# Altium project caton-m-trad.PrjPcb
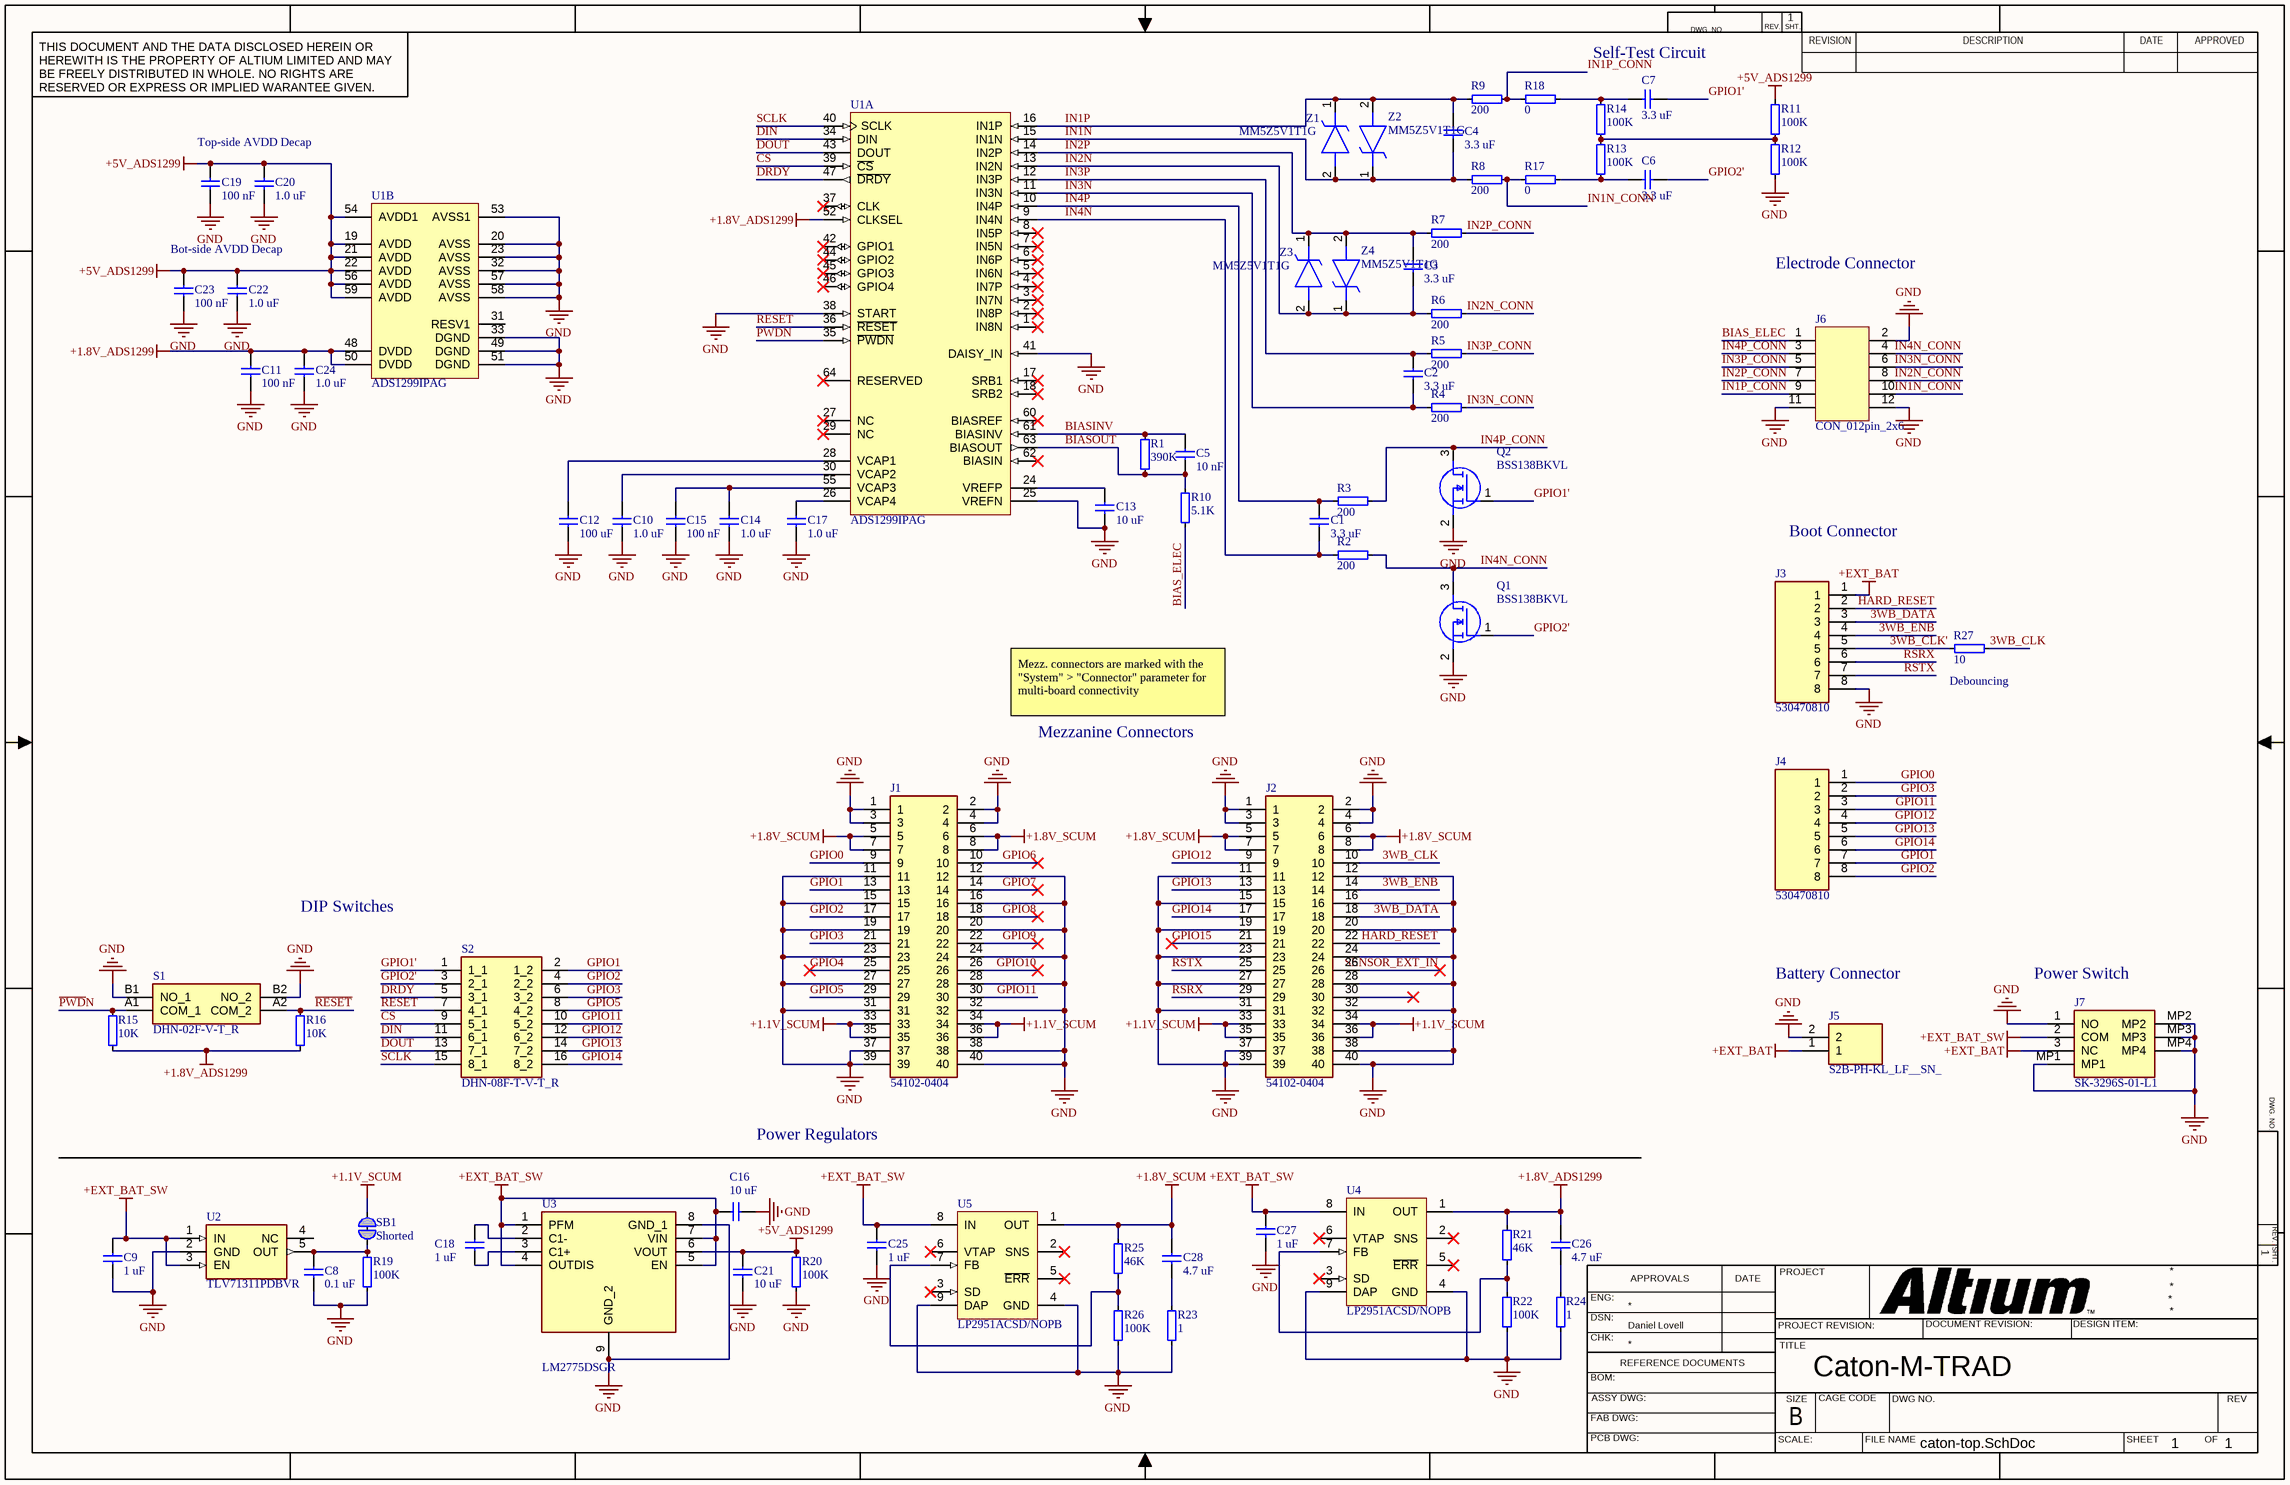
[diagram p0: caton-top.SchDoc]
1 sheet, 76 parts. Net scope: hierarchical (ports join the sheet entries above them; power ports are global).
Board file: caton.PcbDoc

## Sheet caton-top.SchDoc: Caton-M-TRAD
size 431 x 279 mm; Date: 7/9/2024; Author: Daniel Lovell; CompanyName: University of California, Berkeley; DrawnBy: Daniel Lovell; Organization: BSAC; Revision: A; SheetNumber: 1; SheetTotal: 1

### Parts
C1  3.3 uF  [0402]
C2  3.3 uF  [0402]
C3  3.3 uF  [0402]
C4  3.3 uF  [0402]
C5  10 nF  [0402]
C6  3.3 uF  [0402]
C7  3.3 uF  [0402]
C8  0.1 uF  [0402]
C9  1 uF  [0402]
C10  1.0 uF  [0402]
C11  100 nF  [0402]
C12  100 uF  [0805]
C13  10 uF  [0402]
C14  1.0 uF  [0402]
C15  100 nF  [0402]
C16  10 uF  [0402]
C17  1.0 uF  [0402]
C18  1 uF  [0402]
C19  100 nF  [0402]
C20  1.0 uF  [0402]
C21  10 uF  [0402]
C22  1.0 uF  [0402]
C23  100 nF  [0402]
C24  1.0 uF  [0402]
C25  1 uF  [0402]
C26  4.7 uF  [0402]
C27  1 uF  [0402]
C28  4.7 uF  [0402]
J1  54102-0404  [541020404]
J2  54102-0404  [541020404]
J3  530470810  [530470810]
J4  530470810  [530470810]
J5  S2B-PH-KL_LF__SN_  [S2BPHKLLFSN]
J6  CON_012pin_2x6  [CON-012-100-600X200/2X6-POST]
J7  SK-3296S-01-L1  [SK3296S01L1]
Q1  BSS138BKVL  [SOT95P230X110-3N]
Q2  BSS138BKVL  [SOT95P230X110-3N]
R1  390K  [0402]
R2  200  [0402]
R3  200  [0402]
R4  200  [0402]
R5  200  [0402]
R6  200  [0402]
R7  200  [0402]
R8  200  [0402]
R9  200  [0402]
R10  5.1K  [0402]
R11  100K  [0402]
R12  100K  [0402]
R13  100K  [0402]
R14  100K  [0402]
R15  10K  [0402]
R16  10K  [0402]
R17  0  [0603]
R18  0  [0603]
R19  100K  [0402]
R20  100K  [0402]
R21  46K  [0402]
R22  100K  [0402]
R23  1  [0402]
R24  1  [0402]
R25  46K  [0402]
R26  100K  [0402]
R27  10  [0402]
S1  DHN-02F-V-T_R  [DHN02FVTR]
S2  DHN-08F-T-V-T_R  [DHN08FTVTR]
SB1  Shorted  [Solderbridge_Shorted]  (net tie, no BOM)
U1  ADS1299IPAG  [PAG0064A_L]  (parts A,B of 2)
U2  TLV71311PDBVR  [SOT95P280X145-5N]
U3  LM2775DSGR  [SON50P200X200X80-9N]
U4  LP2951ACSD/NOPB  [NGT0008A_V]
U5  LP2951ACSD/NOPB  [NGT0008A_V]
Z1  MM5Z5V1T1G  [SODFL1608X70N]
Z2  MM5Z5V1T1G  [SODFL1608X70N]
Z3  MM5Z5V1T1G  [SODFL1608X70N]
Z4  MM5Z5V1T1G  [SODFL1608X70N]

### Nets
+1.1V_SCUM: J1.33 J1.34 J1.35 J1.36 J2.33 J2.34 J2.35 J2.36 SB1.2
+1.8V_ADS1299: C11.1 C24.1 C26.1 R15.1 R16.1 R21.2 U1.48(DVDD) U1.50(DVDD) U1.52(CLKSEL) U4.1(OUT)
+1.8V_SCUM: C28.1 J1.5 J1.6 J1.7 J1.8 J2.5 J2.6 J2.7 J2.8 R25.2 U5.1(OUT)
+5V_ADS1299: C19.1 C20.1 C21.1 C22.1 C23.1 R11.2 R20.2 U1.19(AVDD) U1.21(AVDD) U1.22(AVDD) U1.54(AVDD1) U1.56(AVDD) U1.59(AVDD) U3.6(VOUT)
+EXT_BAT: J3.1 J5.1 J7.3(NC)
+EXT_BAT_SW: C9.2 C16.1 C25.1 C27.1 J7.2(COM) U2.1(IN) U2.3(EN) U3.1(PFM) U3.4(OUTDIS) U3.5(EN) U3.7(VIN) U4.8(IN) U5.8(IN)
GND: C8.1 C9.1 C10.2 C11.2 C12.2 C13.2 C14.2 C15.2 C16.2 C17.2 C19.2 C20.2 C21.2 C22.2 C23.2 C24.2 C25.2 C27.2 J1.1 J1.2 J1.3 J1.4 J1.11 J1.12 J1.15 J1.16 J1.19 J1.20 J1.23 J1.24 J1.27 J1.28 J1.31 J1.32 J1.37 J1.38 J1.39 J1.40 J2.1 J2.2 J2.3 J2.4 J2.11 J2.12 J2.15 J2.16 J2.19 J2.20 J2.23 J2.24 J2.27 J2.28 J2.31 J2.32 J2.37 J2.38 J2.39 J2.40 J3.8 J5.2 J6.2 J6.11 J6.12 J7.1(NO) J7.MP1 J7.MP2 J7.MP3 J7.MP4 Q1.2(S) Q2.2(S) R12.1 R19.1 R20.1 R22.1 R23.1 R24.1 R26.1 S1.B1(NO_1) S1.B2(NO_2) U1.20(AVSS) U1.23(AVSS) U1.25(VREFN) U1.32(AVSS) U1.33(DGND) U1.38(START) U1.41(DAISY_IN) U1.49(DGND) U1.51(DGND) U1.53(AVSS1) U1.57(AVSS) U1.58(AVSS) U2.2(GND) U3.8(GND_1) U3.9(GND_2) U4.4(GND) U4.9(DAP) U5.4(GND) U5.9(DAP)
3WB_CLK: J2.10 R27.1
3WB_CLK': J3.5 R27.2
3WB_DATA: J2.18 J3.3
3WB_ENB: J2.14 J3.4
~{CS}: S2.9(5_1) U1.39(~{CS})
~{DRDY}: S2.5(3_1) U1.47(~{DRDY})
~{PWD}N: R15.2 S1.A1(COM_1) U1.35(~{PWDN})
~{RESET}: R16.2 S1.A2(COM_2) S2.7(4_1) U1.36(~{RESET})
BIAS_ELEC: J6.1 R10.1
BIASINV: C5.1 R1.2 U1.61(BIASINV)
BIASOUT: C5.2 R1.1 R10.2 U1.63(BIASOUT)
DIN: S2.11(6_1) U1.34(DIN)
DOUT: S2.13(7_1) U1.43(DOUT)
GPIO0: J1.9 J4.1
GPIO1: J1.13 J4.7 S2.2(1_2)
GPIO1': C7.1 Q2.1(G) S2.1(1_1)
GPIO2: J1.17 J4.8 S2.4(2_2)
GPIO2': C6.1 Q1.1(G) S2.3(2_1)
GPIO3: J1.21 J4.2 S2.6(3_2)
GPIO4: J1.25
GPIO5: J1.29 S2.8(4_2)
GPIO6: J1.10
GPIO7: J1.14
GPIO8: J1.18
GPIO9: J1.22
GPIO10: J1.26
GPIO11: J1.30 J4.3 S2.10(5_2)
GPIO12: J2.9 J4.4 S2.12(6_2)
GPIO13: J2.13 J4.5 S2.14(7_2)
GPIO14: J2.17 J4.6 S2.16(8_2)
GPIO15: J2.21
HARD_RESET: J2.22 J3.2
IN1N: C4.1 R8.2 U1.15(IN1N) Z1.2(A) Z2.1(K)
IN1N_CONN: J6.10 R8.1 R17.2
IN1P: C4.2 R9.2 U1.16(IN1P) Z1.1(K) Z2.2(A)
IN1P_CONN: J6.9 R9.1 R18.2
IN2N: C3.1 R6.2 U1.13(IN2N) Z3.2(A) Z4.1(K)
IN2N_CONN: J6.8 R6.1
IN2P: C3.2 R7.2 U1.14(IN2P) Z3.1(K) Z4.2(A)
IN2P_CONN: J6.7 R7.1
IN3N: C2.1 R4.2 U1.11(IN3N)
IN3N_CONN: J6.6 R4.1
IN3P: C2.2 R5.2 U1.12(IN3P)
IN3P_CONN: J6.5 R5.1
IN4N: C1.1 R2.2 U1.9(IN4N)
IN4N_CONN: J6.4 Q1.3(D) R2.1
IN4P: C1.2 R3.2 U1.10(IN4P)
IN4P_CONN: J6.3 Q2.3(D) R3.1
RSRX: J2.29 J3.6
RSTX: J2.25 J3.7
SCLK: S2.15(8_1) U1.40(SCLK)
SENSOR_EXT_IN: J2.26
NetC6_2: C6.2 R13.1 R17.1
NetC7_2: C7.2 R14.2 R18.1
NetC8_2: C8.2 R19.2 SB1.1 U2.5(OUT)
NetC10_1: C10.1 U1.30(VCAP2)
NetC12_1: C12.1 U1.28(VCAP1)
NetC13_1: C13.1 U1.24(VREFP)
NetC14_1: C14.1 C15.1 U1.55(VCAP3)
NetC17_1: C17.1 U1.26(VCAP4)
NetC18_1: C18.1 U3.3(C1+)
NetC18_2: C18.2 U3.2(C1-)
NetC26_2: C26.2 R24.2
NetC28_2: C28.2 R23.2
NetR11_1: R11.1 R12.2 R13.2 R14.1
NetR21_1: R21.1 R22.2 U4.7(FB)
NetR25_1: R25.1 R26.2 U5.7(FB)

Not connected (* = marked no-connect by the designer): J2 30*; U1 1(IN8N)* 2(IN8P)* 3(IN7N)* 4(IN7P)* 5(IN6N)* 6(IN6P)* 7(IN5N)* 8(IN5P)* 17(SRB1)* 18(SRB2)* 27(NC)* 29(NC)* 31(RESV1) 37(CLK)* 42(GPIO1)* 44(GPIO2)* 45(GPIO3)* 46(GPIO4)* 60(BIASREF)* 62(BIASIN)* 64(RESERVED)*; U2 4(NC); U4 2(SNS)* 3(SD)* 5(~{ERR})* 6(VTAP)*; U5 2(SNS)* 3(SD)* 5(~{ERR})* 6(VTAP)*

### Notes on the sheet
- Self-Test Circuit
- Top-side AVDD Decap
- Bot-side AVDD Decap
- Electrode Connector
- Boot Connector
- (near R27) Debouncing
- Mezz. connectors are marked with the "System" > "Connector" parameter for multi-board connectivity
- Mezzanine Connectors
- DIP Switches
- Battery Connector
- (near J7) Power Switch
- Power Regulators
- DWG. NO.
- REV.
- SHT.
- THIS DOCUMENT AND THE DATA DISCLOSED HEREIN OR HEREWITH IS THE PROPERTY OF ALTIUM LIMITED AND MAY BE FREELY DISTRIBUTED IN WHOLE. NO RIGHTS ARE RESERVED OR EXPRESS OR IMPLIED WARANTEE GIVEN.
- REVISION
- DESCRIPTION
- DATE
- APPROVED
- ENG:
- APPROVALS
- PROJECT
- DSN:
- CHK:
- REFERENCE DOCUMENTS
- PROJECT REVISION:
- TITLE
- DOCUMENT REVISION:
- DESIGN ITEM:
- BOM:
- FAB DWG:
- PCB DWG:
- ASSY DWG:
- SCALE:
- SIZE
- B
- CAGE CODE
- FILE NAME
- DWG NO.
- SHEET
- OF
- REV

### Library data of the parts
C1-C7 C10 C11 C13-C15 C17 C19 C20 C22-C24 C26 = C0402: Capacitor, 0402, X5R, ±20%; Part Number: C0402-4µ7; Manufacturer: N.A.; Part number IPS: 00000001251, 00000007165; Note: 10V; Artikkelnr Noca: 20039482; Pad Count: 2; Manufacturer Part Number: N.A.; LatestRevisionDate: 2017-11-09; Published: 2009-05-08; Footprint Doc: 0402; ComponentLink1Description: Datasheet; ComponentLink1URL: N.A.; ComponentLink2Description: Supplier link; ComponentLink2URL: N.A.; HelpURL: N.A.; Supplier 1: Digi-Key; Supplier Part Number 1: 490-13252-1-ND; Supplier 2: N.A.; Supplier Part Number 2: N.A.; PartId: 100200193; Component Class: Capacitors; Author: rsk; Part number Norautron: N.A.
  C1-C4 C6 C7: Value: 3.3 uF
  C5: Value: 10 nF
  C10 C14 C17 C20 C22 C24: Value: 1.0 uF
  C11 C15 C19 C23: Value: 100 nF
  C13: Value: 10 uF
  C26: Value: 4.7 uF
C8 C28 = C0402: Capacitor, 0402, X7R, ±20%; Part Number: C0402-4µ7; Manufacturer: N.A.; Part number IPS: 00000001251, 00000007165; Note: 10V; Artikkelnr Noca: 20039482; Pad Count: 2; Manufacturer Part Number: N.A.; LatestRevisionDate: 2017-11-09; Published: 2009-05-08; Footprint Doc: 0402; ComponentLink1Description: Datasheet; ComponentLink1URL: N.A.; ComponentLink2Description: Supplier link; ComponentLink2URL: N.A.; HelpURL: N.A.; Supplier 1: Digi-Key; Supplier Part Number 1: 490-13252-1-ND; Supplier 2: N.A.; Supplier Part Number 2: N.A.; PartId: 100200193; Component Class: Capacitors; Author: rsk; Part number Norautron: N.A.
  C8: Value: 0.1 uF
  C28: Value: 4.7 uF
C9 C16 C18 C21 C25 C27 = C0402: Capacitor, 0402, X7R, ±10%; Part Number: C0402-4µ7; Manufacturer: N.A.; Part number IPS: 00000001251, 00000007165; Note: 10V; Artikkelnr Noca: 20039482; Pad Count: 2; Manufacturer Part Number: N.A.; LatestRevisionDate: 2017-11-09; Published: 2009-05-08; Footprint Doc: 0402; ComponentLink1Description: Datasheet; ComponentLink1URL: N.A.; ComponentLink2Description: Supplier link; ComponentLink2URL: N.A.; HelpURL: N.A.; Supplier 1: Digi-Key; Supplier Part Number 1: 490-13252-1-ND; Supplier 2: N.A.; Supplier Part Number 2: N.A.; PartId: 100200193; Component Class: Capacitors; Author: rsk; Part number Norautron: N.A.
  C9 C18 C25 C27: Value: 1 uF
  C16 C21: Value: 10 uF
C12 = C0805: Capacitor, 0805; Part Number: C0603-4µ7; Manufacturer: N.A.; Part number IPS: 00000007783; Note: 6.3V; Artikkelnr Noca: 20069060; Pad Count: 2; Manufacturer Part Number: N.A.; LatestRevisionDate: 2009-11-23; Published: 2009-05-08; Value: 100 uF; Footprint Doc: 0603; ComponentLink1Description: Datasheet; ComponentLink1URL: N.A.; ComponentLink2Description: Supplier link; ComponentLink2URL: N.A.; HelpURL: N.A.; Supplier 1: N.A.; Supplier Part Number 1: N.A.; Supplier 2: N.A.; Supplier Part Number 2: N.A.; PartId: 100200274; Component Class: Capacitors; Author: rsk; Part number Norautron: N.A.
J1 J2 = 54102-0404: 0.50mm Pitch SlimStack Receptacle, Surface Mount, Dual Row, Vertical, 2.50mm Stacking Height, Gold Plating with Nickel Barrier, 40 Circuits; Manufacturer_Name: Molex; System: Connector; Datasheet Link: https://www.molex.com/pdm_docs/sd/541020404_sd.pdf; Height: 2.2mm; Manufacturer_Part_Number: 54102-0404; Mouser Part Number: 538-54102-0404; Mouser Price/Stock: https://www.mouser.co.uk/ProductDetail/Molex/54102-0404?qs=QVBMgXxBiLzLp7HESxZcuA%3D%3D
J3 J4 = 530470810: Connector; Manufacturer_Name: Molex; Datasheet Link: https://www.molex.com/pdm_docs/sd/530470210_sd.pdf; Height: 4.2mm; Manufacturer_Part_Number: 530470810
J5 = S2B-PH-KL_LF__SN_: Connector; Manufacturer_Name: JST (JAPAN SOLDERLESS TERMINALS); Manufacturer_Part_Number: S2B-PH-KL(LF)(SN); Datasheet Link: https://www.jst-mfg.com/product/pdf/eng/ePH.pdf; Height: 4.8mm
J6 = CON_012pin_2x6: Con 12 pins 2x6
J7 = SK-3296S-01-L1: Connector; Manufacturer_Name: XKB Connectivity; Datasheet Link: https://datasheet.lcsc.com/szlcsc/XKB-SK-3296S-01-L1_C319020.pdf; Height: 1.4mm; Manufacturer_Part_Number: SK-3296S-01-L1
Q1 Q2 = BSS138BKVL: MOSFET (N-Channel); Manufacturer_Name: Nexperia; Datasheet Link: https://assets.nexperia.com/documents/data-sheet/BSS138BK.pdf; Height: 1.1mm; Manufacturer_Part_Number: BSS138BKVL; Mouser Part Number: 771-BSS138BKVL; Mouser Price/Stock: https://www.mouser.co.uk/ProductDetail/Nexperia/BSS138BKVL?qs=45Avz0nZxhsC3lw2Q7S%2FBA%3D%3D; Arrow Part Number: BSS138BKVL; Arrow Price/Stock: https://www.arrow.com/en/products/bss138bkvl/nexperia?region=europe
R1-R16 R19-R27 = R0402: Resistor, 0402, ±1%, 0.05W; Part Number: R0201-10k; Manufacturer: N.A.; Part number IPS: 00000001255; Note: Chip Res 1%; Pad Count: 2; Manufacturer Part Number: N.A.; LatestRevisionDate: 2014-11-13; Published: 2014-11-13; Artikkelnr Noca: N.A.; Footprint Doc: 0201; ComponentLink1Description: Datasheet; ComponentLink1URL: N.A.; ComponentLink2Description: Supplier link; ComponentLink2URL: N.A.; HelpURL: N.A.; Supplier 1: N.A.; Supplier Part Number 1: N.A.; Supplier 2: N.A.; Supplier Part Number 2: N.A.; PartId: 100100065; Component Class: Resistors; Author: rsk; Part number Norautron: N.A.
  R1: Value: 390K
  R2-R9: Value: 200
  R10: Value: 5.1K
  R11-R14 R19 R20 R22 R26: Value: 100K
  R15 R16: Value: 10K
  R21 R25: Value: 46K
  R23 R24: Value: 1
  R27: Value: 10
R17 R18 = R0603: Resistor, 0603; Part Number: R0201-10k; Manufacturer: N.A.; Part number IPS: 00000001255; Note: Chip Res 1%; Pad Count: 2; Manufacturer Part Number: N.A.; LatestRevisionDate: 2014-11-13; Published: 2014-11-13; Value: 0; Artikkelnr Noca: N.A.; Footprint Doc: 0201; ComponentLink1Description: Datasheet; ComponentLink1URL: N.A.; ComponentLink2Description: Supplier link; ComponentLink2URL: N.A.; HelpURL: N.A.; Supplier 1: N.A.; Supplier Part Number 1: N.A.; Supplier 2: N.A.; Supplier Part Number 2: N.A.; PartId: 100100065; Component Class: Resistors; Author: rsk; Part number Norautron: N.A.
S1 = DHN-02F-V-T_R: Switch; Manufacturer_Name: Diptronics; Manufacturer_Part_Number: DHN-02F-V-T/R; Datasheet Link: https://www.mouser.com/datasheet/2/910/377_DHNF-1571321.pdf; Height: 1.65mm; Mouser Part Number: 113-DHN02FVTR; Mouser Price/Stock: https://www.mouser.co.uk/ProductDetail/Diptronics/DHN-02F-V-T-R?qs=MLItCLRbWsyqCqWUbs6C5Q%3D%3D
S2 = DHN-08F-T-V-T_R: Switch; Manufacturer_Name: Diptronics; Manufacturer_Part_Number: DHN-08F-T-V-T/R; Datasheet Link: https://www.mouser.com/datasheet/2/910/377_DHNF-1571321.pdf; Height: 1.53mm; Mouser Part Number: 113-DHN08FTVTR; Mouser Price/Stock: https://www.mouser.co.uk/ProductDetail/Diptronics/DHN-08F-T-V-T-R?qs=MLItCLRbWsx18ED%2FADfjTQ%3D%3D
SB1 = Solderbridge Shorted: Shorted Solderbridge; Manufacturer: N.A.; Pad Count: 2; Part Number: Solderbridge Shorted; Manufacturer Part Number: N.A.; Footprint Doc: Solderbridge_Shorted; LatestRevisionDate: 2012-08-07; Published: 2012-08-07; Value: Shorted; Note: N.A.; Artikkelnr Noca: N.A.; Part number IPS: N.A.; ComponentLink1Description: Datasheet; ComponentLink1URL: N.A.; ComponentLink2Description: Supplier link; ComponentLink2URL: N.A.; HelpURL: N.A.; Supplier 1: N.A.; Supplier Part Number 1: N.A.; Supplier 2: N.A.; Supplier Part Number 2: N.A.; PartId: 100500459; Component Class: Connectors; Author: rsk; Part number Norautron: N.A.
U1 = CMP-0841-00002-2: Low-Noise, 8-Channel, 24-Bit Analog Front-End for Biopotential Measurement, 16 KSPS, -40 to 85 degC, 64-Pin PQFP (PAG-64), RoHS, Tube; Manufacturer: Texas Instruments; Architecture: Delta-Sigma; Reference Mode: Int, Ext; # Input Channels: 8; Resolution (Bits): 24; Sample Rate (max) (KSPS): 16; Interface: Serial SPI; Packing: PAG0064A; PackageVersion: 4040282/C; PackageReference: PAG-64; ComponentLink3Description: Package Specification; DatasheetVersion: SBAS499A; ComponentLink1Description: Manufacturer URL; ComponentLink2Description: Datasheet; PackageDescription: 64-Pin Plastic Quad Flatpack, Body 10 x 10 mm, Pitch 0.5 mm; RoHS: TRUE; Operating Temperature Range (C): -40 to 85; ComponentLink3URL: http://www.ti.com/lit/ml/mtqf006a/mtqf006a.pdf; ComponentLink1URL: http://www.ti.com/; ComponentLink2URL: http://www.ti.com/lit/ds/symlink/ads1299.pdf; PartNumber: ADS1299IPAG; Mounting Technology: Surface Mount
U2 = TLV71311PDBVR: Integrated Circuit; Manufacturer_Name: Texas Instruments; Datasheet Link: http://www.ti.com/lit/gpn/tlv713p; Height: 1.45mm; Manufacturer_Part_Number: TLV71311PDBVR; Mouser Part Number: 595-TLV71311PDBVR; Mouser Price/Stock: https://www.mouser.com/Search/Refine.aspx?Keyword=595-TLV71311PDBVR; Arrow Part Number: TLV71311PDBVR; Arrow Price/Stock: https://www.arrow.com/en/products/tlv71311pdbvr/texas-instruments
U3 = LM2775DSGR: Integrated Circuit; Manufacturer_Name: Texas Instruments; Datasheet Link: http://www.ti.com/lit/ds/symlink/lm2775.pdf; Height: 0.8mm; Manufacturer_Part_Number: LM2775DSGR; Mouser Part Number: 595-LM2775DSGR; Mouser Price/Stock: https://www.mouser.co.uk/ProductDetail/Texas-Instruments/LM2775DSGR?qs=GURawfaeGuBqI9Vb8ZKJyg%3D%3D; Arrow Part Number: LM2775DSGR; Arrow Price/Stock: https://www.arrow.com/en/products/lm2775dsgr/texas-instruments
U4 U5 = CMP-0062-01430-3: Series of Adjustable Micropower Voltage Regulators, 8-pin LLP, Pb-Free; Manufacturer: Texas Instruments; PackageTopMarking: NS*UZXYTT*2951AC; CompType: LDO IC; PowerWise: N; ComponentLink1URL: http://www.ti.com/general/docs/lit/getliterature.tsp?genericPartNumber=LP2951-N&fileType=pdf; PackageDescription: LLP, Plastic, Dual, 4 x 4 x 0.8mm Body, 8 Lead, 0.8mm Pitch, No Pullback; ComponentLink1Description: Datasheet URL; PackageReference: NGT0008A; PinCount: 8; RoHS: Y
Z1-Z4 = MM5Z5V1T1G: Zener Diode; Manufacturer_Name: onsemi; Datasheet Link: http://www.onsemi.com/pub/Collateral/MM5Z2V4T1-D.PDF; Height: 0.7mm; Manufacturer_Part_Number: MM5Z5V1T1G; Mouser Part Number: 863-MM5Z5V1T1G; Mouser Price/Stock: https://www.mouser.co.uk/ProductDetail/onsemi/MM5Z5V1T1G?qs=HVbQlW5zcXWngQFSpylEhA%3D%3D; Arrow Part Number: MM5Z5V1T1G; Arrow Price/Stock: https://www.arrow.com/en/products/mm5z5v1t1g/on-semiconductor?region=nac